# EAGLE schematic DisplayBoard (EAGLE 9.5.2)
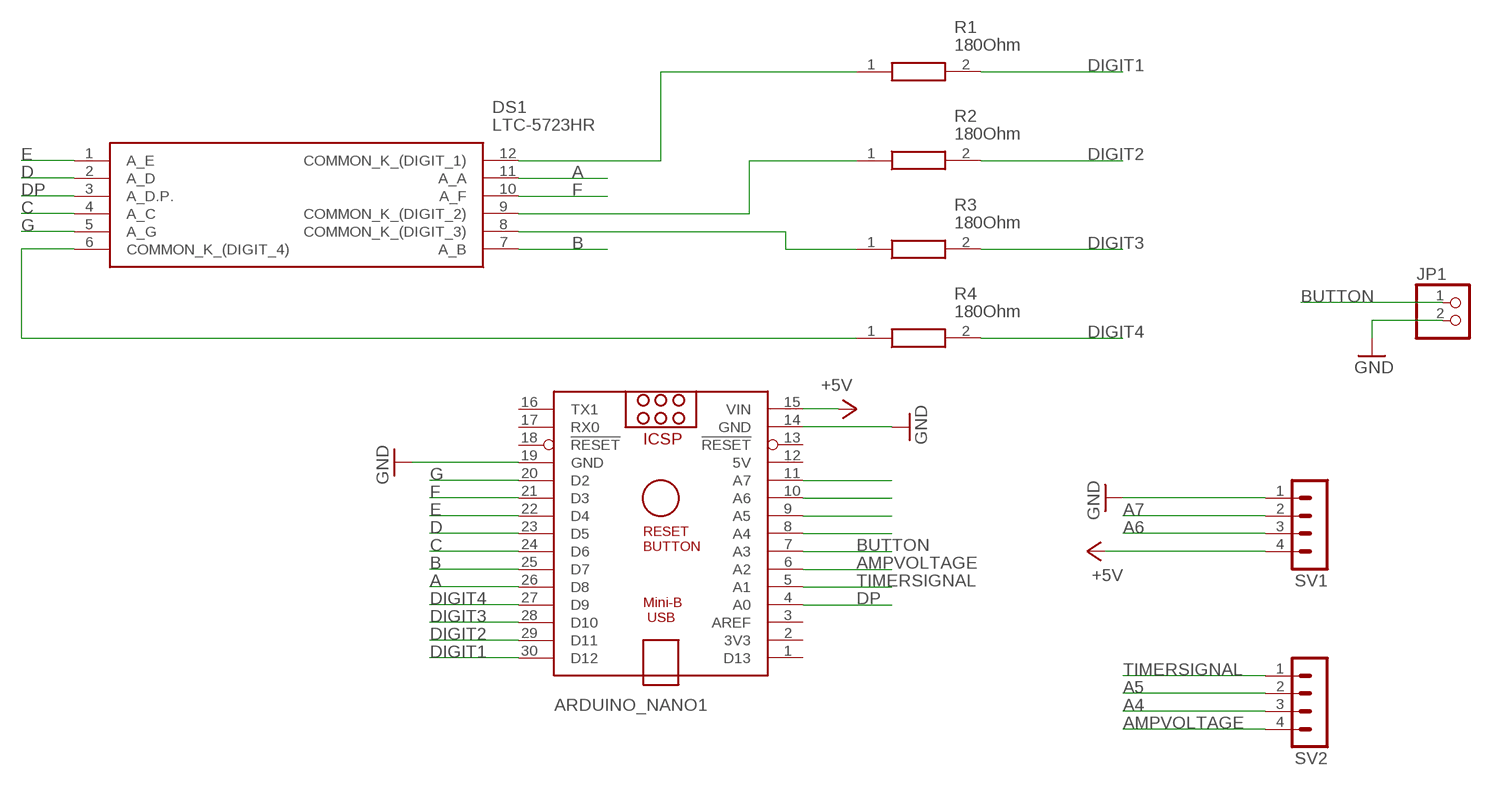
[diagram p0: schematic, sheet 1]

## Parts
ARDUINO_NANO1  ARDUINO_NANO  [ARDUINO_NANO]
DS1  LTC-5723HR  [DIP1524W75P254L5030H825Q12N]
JP1  PINHD-1X2  [1X02]
R1  180Ohm  ERA-6AEB181V  [RESC2012X60N]
R2  180Ohm  ERA-6AEB181V  [RESC2012X60N]
R3  180Ohm  ERA-6AEB181V  [RESC2012X60N]
R4  180Ohm  ERA-6AEB181V  [RESC2012X60N]
SV1  MA04-1  [MA04-1]
SV2  MA04-1  [MA04-1]

## Nets
+5V: ARDUINO_NANO1.15(VIN) SV1.4
A: ARDUINO_NANO1.26(D8) DS1.11(A_A)
A4: SV2.3
A5: SV2.2
A6: SV1.3
A7: SV1.2
AMPVOLTAGE: ARDUINO_NANO1.6(A2) SV2.4
B: ARDUINO_NANO1.25(D7) DS1.7(A_B)
BUTTON: ARDUINO_NANO1.7(A3) JP1.1
C: ARDUINO_NANO1.24(D6) DS1.4(A_C)
D: ARDUINO_NANO1.23(D5) DS1.2(A_D)
DIGIT1: ARDUINO_NANO1.30(D12) R1.2
DIGIT2: ARDUINO_NANO1.29(D11) R2.2
DIGIT3: ARDUINO_NANO1.28(D10) R3.2
DIGIT4: ARDUINO_NANO1.27(D9) R4.2
DP: ARDUINO_NANO1.4(A0) DS1.3(A_D.P.)
E: ARDUINO_NANO1.22(D4) DS1.1(A_E)
F: ARDUINO_NANO1.21(D3) DS1.10(A_F)
G: ARDUINO_NANO1.20(D2) DS1.5(A_G)
GND: ARDUINO_NANO1.14(GND) ARDUINO_NANO1.19(GND) JP1.2 SV1.1
N$1: DS1.12(COMMON_K_(DIGIT_1)) R1.1
N$2: DS1.9(COMMON_K_(DIGIT_2)) R2.1
N$3: DS1.8(COMMON_K_(DIGIT_3)) R3.1
N$4: DS1.6(COMMON_K_(DIGIT_4)) R4.1
N$5: ARDUINO_NANO1.11(A7)
N$6: ARDUINO_NANO1.10(A6)
N$7: ARDUINO_NANO1.9(A5)
N$8: ARDUINO_NANO1.8(A4)
TIMERSIGNAL: ARDUINO_NANO1.5(A1) SV2.1
Unconnected: ARDUINO_NANO1.1(D13) ARDUINO_NANO1.2(3V3) ARDUINO_NANO1.3(AREF) ARDUINO_NANO1.13(!RESET) ARDUINO_NANO1.16(TX1) ARDUINO_NANO1.17(RX0) ARDUINO_NANO1.18(!RESET)

## Power pins joined to a net without a drawn wire
5V: ARDUINO_NANO1.12(5V)

## Library data of the parts
ARDUINO_NANO1 = ArduinoNanoV30:ARDUINO_NANO: Arduino Nano V3.0 Overview: The Arduino Nano is a small, complete, and breadboard-friendly board based on the ATmega328 (Arduino Nano 3.x) or ATmega168 (Arduino Nano 2.x). It has more or less the same functionality of the Arduino Duemilanove, but in a different package. It lacks only a DC power jack, and works with a Mini-B USB cable instead of a standard one. The Nano was designed and is being produced by Gravitech. Specifications: Microcontroller Atmel ATmega168 or ATmega328 Operating Voltage (logic level) 5 V Input Voltage (recommended) 7-12 V Input Voltage (limits) 6-20 V Digital I/O Pins 14 (of which 6 provide PWM output) Analog Input Pins 8 DC Current per I/O Pin 40 mA Flash Memory 16 KB (ATmega168) or 32 KB (ATmega328) of which 2 KB used by bootloader SRAM 1 KB (ATmega168) or 2 KB (ATmega328) EEPROM 512 bytes (ATmega168) or 1 KB (ATmega328) Clock Speed 16 MHz Dimensions 0.73" x 1.70" Length 45 mm Width 18 mm Weigth 5 g Power: The Arduino Nano can be powered via the Mini-B USB connection, 6-20V unregulated external power supply (pin 30), or 5V regulated external power supply (pin 27). The power source is automatically selected to the highest voltage source. Memory: The ATmega168 has 16 KB of flash memory for storing code (of which 2 KB is used for the bootloader); the ATmega328 has 32 KB, (also with 2 KB used for the bootloader). The ATmega168 has 1 KB of SRAM and 512 bytes of EEPROM (which can be read and written with the EEPROM library); the ATmega328 has 2 KB of SRAM and 1 KB of EEPROM. Input and Output: Each of the 14 digital pins on the Nano can be used as an input or output, using pinMode(), digitalWrite(), and digitalRead() functions. They operate at 5 volts. Each pin can provide or receive a maximum of 40 mA and has an internal pull-up resistor (disconnected by default) of 20-50 kOhms. In addition, some pins have specialized functions. Visit Arduino - ArduinoBoardNano <https://www.arduino.cc/en/Main/ArduinoBoardNano>
DS1 = SamacSys_Parts:LTC-5723HR: LED Displays & Accessories 4 Digit, Red Source: Datasheet <https://componentsearchengine.com/Datasheets/1/LTC-5723HR.pdf>; DESCRIPTION: LED Displays & Accessories 4 Digit, Red; HEIGHT: 8.25mm; MANUFACTURER_NAME: Lite-On; MANUFACTURER_PART_NUMBER: LTC-5723HR; MOUSER_PART_NUMBER: 859-LTC-5723HR; MOUSER_PRICE-STOCK: https://www.mouser.com/Search/Refine.aspx?Keyword=859-LTC-5723HR
JP1 = pinhead:PINHD-1X2: PIN HEADER
R1-R4 = SamacSys_Parts:ERA-6AEB181V: RESISTOR, 0805 180 Ohm +/-0.1 % 0.125 W Source: Datasheet <https://componentsearchengine.com/Datasheets/1/ERA-6AEB181V.pdf>; DESCRIPTION: RESISTOR, 0805 180 Ohm +/-0.1 % 0.125 W; HEIGHT: 0.6mm; MANUFACTURER_NAME: Panasonic; MANUFACTURER_PART_NUMBER: ERA-6AEB181V; MOUSER_PART_NUMBER: 667-ERA-6AEB181V; MOUSER_PRICE-STOCK: http://www.mouser.com/Search/ProductDetail.aspx?qs=nho8PGNfA6oPgHeQL3PyZg%3d%3d
SV1 SV2 = con-lstb:MA04-1: PIN HEADER; OC_FARNELL: unknown; OC_NEWARK: unknown